# Altium schematic sheet V__7.SchDoc
size A4
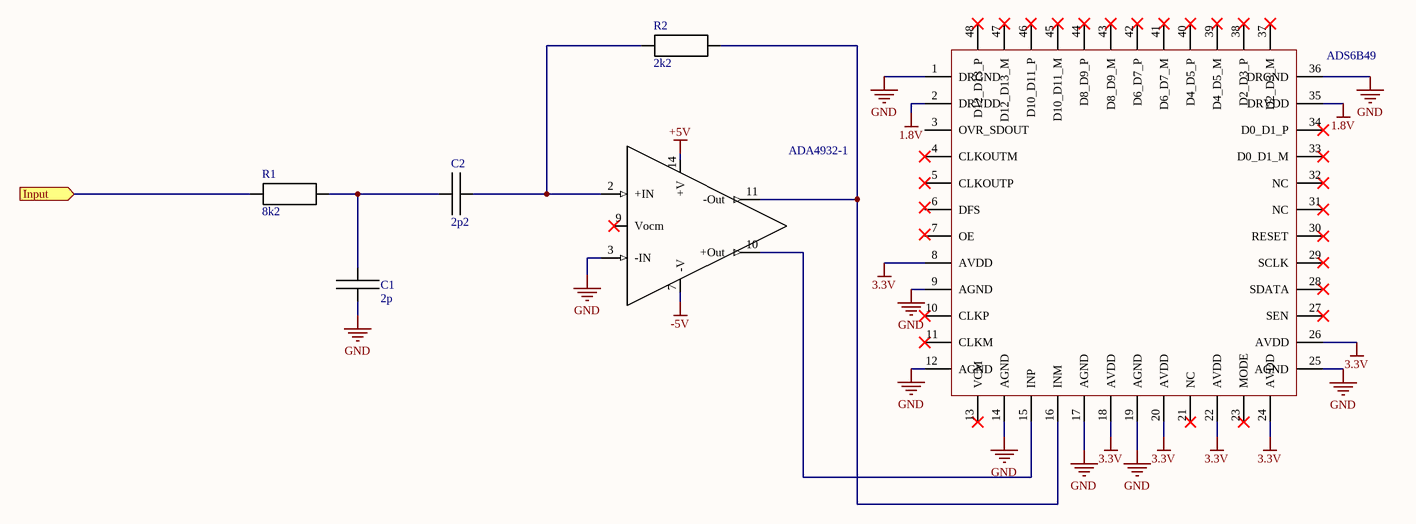
[diagram p0: V__7.SchDoc]

## Parts
2  ADS6B49  [ADS]
3  ADA4932-1  [ADA]
C1  2p  [C]
C2  2p2  [C]
R1  8k2  [R]
R2  2k2  [R]

## Ports
Input (in)

## Nets
1.8V: 2.2(DRVDD) 2.35(DRVDD)
3.3V: 2.8(AVDD) 2.18(AVDD) 2.20(AVDD) 2.22(AVDD) 2.24(AVDD) 2.26(AVDD)
+5V: 3.14(+V)
-5V: 3.7(-V)
GND: 2.1(DRGND) 2.9(AGND) 2.12(AGND) 2.14(AGND) 2.17(AGND) 2.19(AGND) 2.25(AGND) 2.36(DRGND) 3.3(-IN) C1.1
Input: R1.1 ; port Input
Net2_15: 2.15(INP) 3.10(+Out)
Net2_16: 2.16(INM) 3.11(-Out) R2.2
Net3_2: 3.2(+IN) C2.2 R2.1
NetC1_2: C1.2 C2.1 R1.2

Not connected (* = marked no-connect by the designer): 2 3(OVR_SDOUT) 4(CLKOUTM)* 5(CLKOUTP)* 6(DFS) 7(OE) 10(CLKP)* 11(CLKM)* 13(VCM)* 21(NC)* 23(MODE)* 27(SEN)* 28(SDATA)* 29(SCLK)* 30(RESET)* 31(NC)* 32(NC)* 33(D0_D1_M)* 34(D0_D1_P)* 37(D2_D3_M)* 38(D2_D3_P)* 39(D4_D5_M)* 40(D4_D5_P)* 41(D6_D7_M)* 42(D6_D7_P)* 43(D8_D9_M)* 44(D8_D9_P)* 45(D10_D11_M)* 46(D10_D11_P)* 47(D12_D13_M)* 48(D12_D13_P)*; 3 9(Vocm)*

## Library data of the parts
3 = ADA4932-2
C1 C2 = С
R1 R2 = R